# EAGLE board untitled (EAGLE 9.6.2)
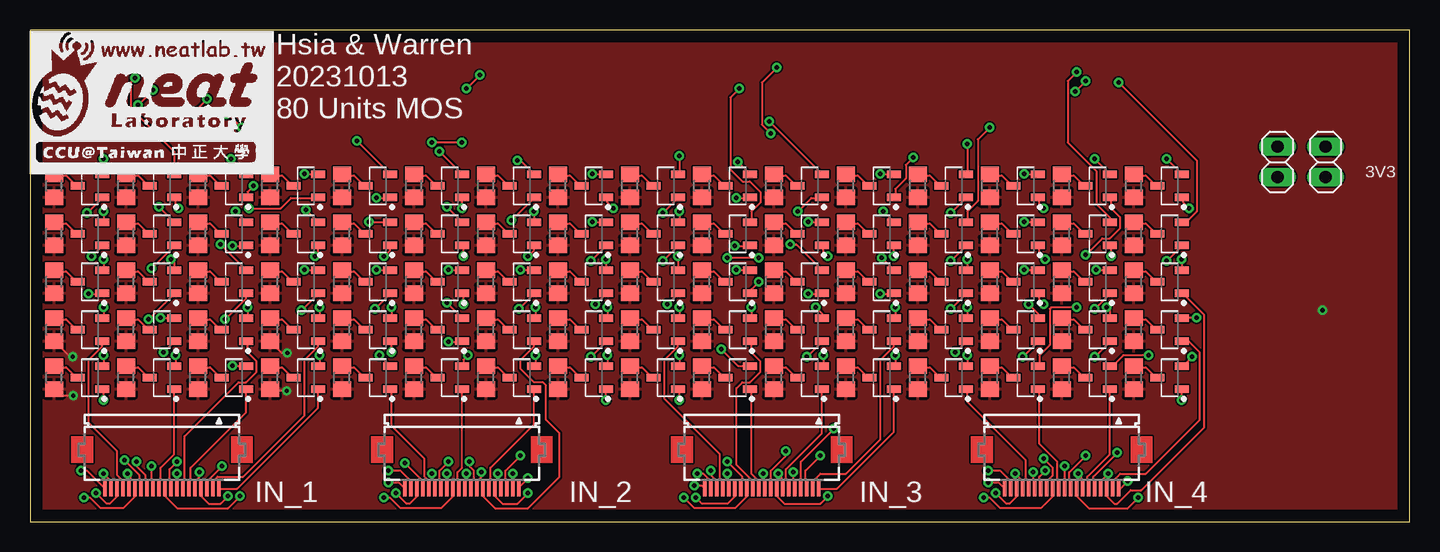
[diagram p1: board, top side]
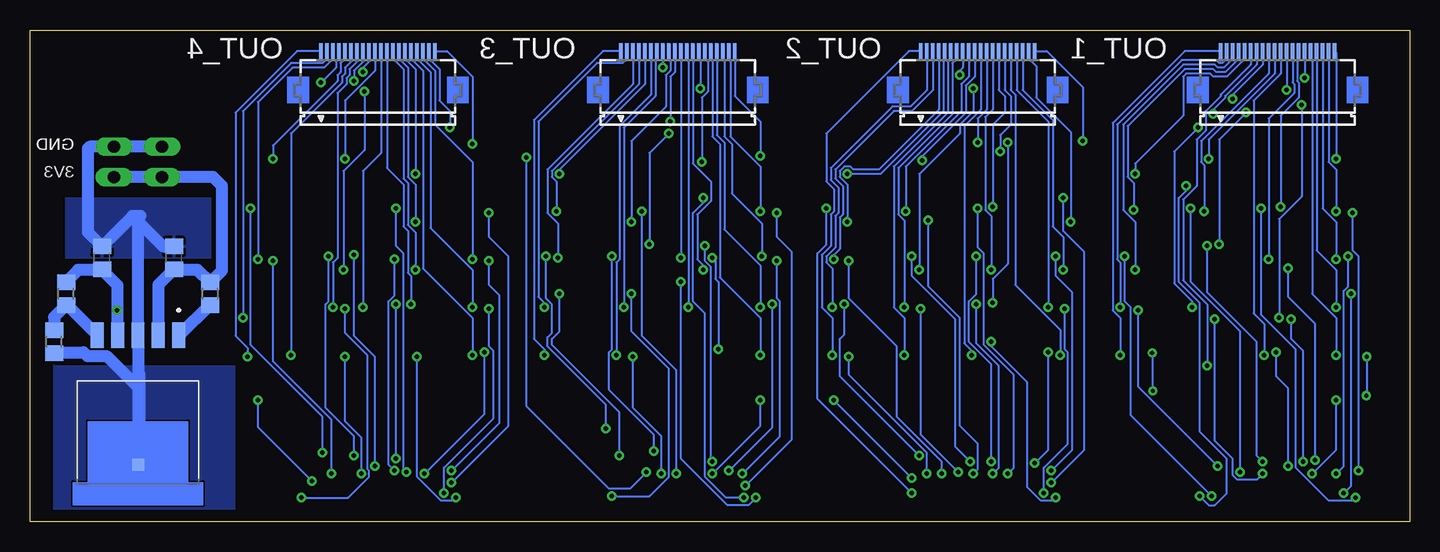
[diagram p2: board, bottom side, seen from below]

Size 115 x 41 mm. Coordinates in mm from the lower left corner, seen from the top.
Outline: 0,0 115,0 115,41 0,41 0,0
Copper layers (1*16): Top 0.035mm / dielectric 1.5mm / Bottom 0.035mm
Design rules "default": minimum track width 6mil, minimum drill 0.35mm, track to track 6mil, track to pad 6mil, pad to pad 6mil, via to via 6mil, smd to smd 6mil, copper to edge 40mil, drill to drill 6mil, minimum pad ring 10mil, minimum via ring 8mil, stop-mask expansion 4mil, vias tented up to drill 0mil, thermal gap 10mil

## Footprints (pad centres in the part's own frame; a part is rotated, then mirrored left to right if it is on the bottom)
FH12-20S-0.5SH = smd 0.3 x 1.3: 1 -4.75,3.25; 2 -4.25,3.25; 3 -3.75,3.25; 4 -3.25,3.25; 5 -2.75,3.25; 6 -2.25,3.25; 7 -1.75,3.25; 8 -1.25,3.25; 9 -0.75,3.25; 10 -0.25,3.25; 11 0.25,3.25; 12 0.75,3.25; 13 1.25,3.25; 14 1.75,3.25; 15 2.25,3.25; 16 2.75,3.25; 17 3.25,3.25; 18 3.75,3.25; 19 4.25,3.25; 20 4.75,3.25
1X02 = drill 1.016 long: 1 -1.27,0; 2 1.27,0
LP38501TS_ADJ = smd 2.16 x 1.07: ADJ -6.545,-3.4; EN -6.545,3.4; GND -6.545,0; IN -6.545,1.7; OUT -6.545,-1.7 | smd 1 x 1: DAP 4.255,0
C0805 = smd 1.3 x 1.5: 1 -0.95,0; 2 0.95,0
R0805 = smd 1.3 x 1.5: 1 -0.95,0; 2 0.95,0
SOT95P240X110-3N = smd 1.18 x 0.609: 1 -1.024,0.95; 2 -1.024,-0.95; 3 1.024,0

## Placement (x,y rotation side)
FI1  FH12-20S-0.5SH  [FH12-20S-0.5SH]  11,6 180 top
FI2  FH12-20S-0.5SH  [FH12-20S-0.5SH]  36,6 180 top
FI3  FH12-20S-0.5SH  [FH12-20S-0.5SH]  61,6 180 top
FI4  FH12-20S-0.5SH  [FH12-20S-0.5SH]  86,6 180 top
FO1  FH12-20S-0.5SH  [FH12-20S-0.5SH]  11,36 0 bottom
FO2  FH12-20S-0.5SH  [FH12-20S-0.5SH]  36,36 0 bottom
FO3  FH12-20S-0.5SH  [FH12-20S-0.5SH]  61,36 0 bottom
FO4  FH12-20S-0.5SH  [FH12-20S-0.5SH]  86,36 0 bottom
JP1  [1X02]  104,30 90 top
JP2  [1X02]  108,30 90 top
LDO  [LP38501TS_ADJ]  106,9 270 bottom
LDO_C1  10uF  [C0805]  103,22 90 bottom
LDO_C2  10uF  [C0805]  109,22 90 bottom
LDO_R1  3.3k  [R0805]  112,19 90 bottom
LDO_R2  6.8k  [R0805]  113,15 90 bottom
LDO_R3  10k  [R0805]  100,19 270 bottom
MOS1  NX6008NBKNX6008NBK  [SOT95P240X110-3N]  23,12 180 top
MOS2  NX6008NBKNX6008NBK  [SOT95P240X110-3N]  23,16 180 top
MOS3  NX6008NBKNX6008NBK  [SOT95P240X110-3N]  23,20 180 top
MOS4  NX6008NBKNX6008NBK  [SOT95P240X110-3N]  23,24 180 top
MOS5  NX6008NBKNX6008NBK  [SOT95P240X110-3N]  23,28 180 top
MOS6  NX6008NBKNX6008NBK  [SOT95P240X110-3N]  17,12 180 top
MOS7  NX6008NBKNX6008NBK  [SOT95P240X110-3N]  17,16 180 top
MOS8  NX6008NBKNX6008NBK  [SOT95P240X110-3N]  17,20 180 top
MOS9  NX6008NBKNX6008NBK  [SOT95P240X110-3N]  17,24 180 top
MOS10  NX6008NBKNX6008NBK  [SOT95P240X110-3N]  17,28 180 top
MOS11  NX6008NBKNX6008NBK  [SOT95P240X110-3N]  11,12 180 top
MOS12  NX6008NBKNX6008NBK  [SOT95P240X110-3N]  11,16 180 top
MOS13  NX6008NBKNX6008NBK  [SOT95P240X110-3N]  11,20 180 top
MOS14  NX6008NBKNX6008NBK  [SOT95P240X110-3N]  11,24 180 top
MOS15  NX6008NBKNX6008NBK  [SOT95P240X110-3N]  11,28 180 top
MOS16  NX6008NBKNX6008NBK  [SOT95P240X110-3N]  5,12 180 top
MOS17  NX6008NBKNX6008NBK  [SOT95P240X110-3N]  5,16 180 top
MOS18  NX6008NBKNX6008NBK  [SOT95P240X110-3N]  5,20 180 top
MOS19  NX6008NBKNX6008NBK  [SOT95P240X110-3N]  5,24 180 top
MOS20  NX6008NBKNX6008NBK  [SOT95P240X110-3N]  5,28 180 top
MOS21  NX6008NBKNX6008NBK  [SOT95P240X110-3N]  47,12 180 top
MOS22  NX6008NBKNX6008NBK  [SOT95P240X110-3N]  47,16 180 top
MOS23  NX6008NBKNX6008NBK  [SOT95P240X110-3N]  47,20 180 top
MOS24  NX6008NBKNX6008NBK  [SOT95P240X110-3N]  47,24 180 top
MOS25  NX6008NBKNX6008NBK  [SOT95P240X110-3N]  47,28 180 top
MOS26  NX6008NBKNX6008NBK  [SOT95P240X110-3N]  41,12 180 top
MOS27  NX6008NBKNX6008NBK  [SOT95P240X110-3N]  41,16 180 top
MOS28  NX6008NBKNX6008NBK  [SOT95P240X110-3N]  41,20 180 top
MOS29  NX6008NBKNX6008NBK  [SOT95P240X110-3N]  41,24 180 top
MOS30  NX6008NBKNX6008NBK  [SOT95P240X110-3N]  41,28 180 top
MOS31  NX6008NBKNX6008NBK  [SOT95P240X110-3N]  35,12 180 top
MOS32  NX6008NBKNX6008NBK  [SOT95P240X110-3N]  35,16 180 top
MOS33  NX6008NBKNX6008NBK  [SOT95P240X110-3N]  35,20 180 top
MOS34  NX6008NBKNX6008NBK  [SOT95P240X110-3N]  35,24 180 top
MOS35  NX6008NBKNX6008NBK  [SOT95P240X110-3N]  35,28 180 top
MOS36  NX6008NBKNX6008NBK  [SOT95P240X110-3N]  29,12 180 top
MOS37  NX6008NBKNX6008NBK  [SOT95P240X110-3N]  29,16 180 top
MOS38  NX6008NBKNX6008NBK  [SOT95P240X110-3N]  29,20 180 top
MOS39  NX6008NBKNX6008NBK  [SOT95P240X110-3N]  29,24 180 top
MOS40  NX6008NBKNX6008NBK  [SOT95P240X110-3N]  29,28 180 top
MOS41  NX6008NBKNX6008NBK  [SOT95P240X110-3N]  71,12 180 top
MOS42  NX6008NBKNX6008NBK  [SOT95P240X110-3N]  71,16 180 top
MOS43  NX6008NBKNX6008NBK  [SOT95P240X110-3N]  71,20 180 top
MOS44  NX6008NBKNX6008NBK  [SOT95P240X110-3N]  71,24 180 top
MOS45  NX6008NBKNX6008NBK  [SOT95P240X110-3N]  71,28 180 top
MOS46  NX6008NBKNX6008NBK  [SOT95P240X110-3N]  65,12 180 top
MOS47  NX6008NBKNX6008NBK  [SOT95P240X110-3N]  65,16 180 top
MOS48  NX6008NBKNX6008NBK  [SOT95P240X110-3N]  65,20 180 top
MOS49  NX6008NBKNX6008NBK  [SOT95P240X110-3N]  65,24 180 top
MOS50  NX6008NBKNX6008NBK  [SOT95P240X110-3N]  65,28 180 top
MOS51  NX6008NBKNX6008NBK  [SOT95P240X110-3N]  59,12 180 top
MOS52  NX6008NBKNX6008NBK  [SOT95P240X110-3N]  59,16 180 top
MOS53  NX6008NBKNX6008NBK  [SOT95P240X110-3N]  59,20 180 top
MOS54  NX6008NBKNX6008NBK  [SOT95P240X110-3N]  59,24 180 top
MOS55  NX6008NBKNX6008NBK  [SOT95P240X110-3N]  59,28 180 top
MOS56  NX6008NBKNX6008NBK  [SOT95P240X110-3N]  53,12 180 top
MOS57  NX6008NBKNX6008NBK  [SOT95P240X110-3N]  53,16 180 top
MOS58  NX6008NBKNX6008NBK  [SOT95P240X110-3N]  53,20 180 top
MOS59  NX6008NBKNX6008NBK  [SOT95P240X110-3N]  53,24 180 top
MOS60  NX6008NBKNX6008NBK  [SOT95P240X110-3N]  53,28 180 top
MOS61  NX6008NBKNX6008NBK  [SOT95P240X110-3N]  95,12 180 top
MOS62  NX6008NBKNX6008NBK  [SOT95P240X110-3N]  95,16 180 top
MOS63  NX6008NBKNX6008NBK  [SOT95P240X110-3N]  95,20 180 top
MOS64  NX6008NBKNX6008NBK  [SOT95P240X110-3N]  95,24 180 top
MOS65  NX6008NBKNX6008NBK  [SOT95P240X110-3N]  95,28 180 top
MOS66  NX6008NBKNX6008NBK  [SOT95P240X110-3N]  89,12 180 top
MOS67  NX6008NBKNX6008NBK  [SOT95P240X110-3N]  89,16 180 top
MOS68  NX6008NBKNX6008NBK  [SOT95P240X110-3N]  89,20 180 top
MOS69  NX6008NBKNX6008NBK  [SOT95P240X110-3N]  89,24 180 top
MOS70  NX6008NBKNX6008NBK  [SOT95P240X110-3N]  89,28 180 top
MOS71  NX6008NBKNX6008NBK  [SOT95P240X110-3N]  83,12 180 top
MOS72  NX6008NBKNX6008NBK  [SOT95P240X110-3N]  83,16 180 top
MOS73  NX6008NBKNX6008NBK  [SOT95P240X110-3N]  83,20 180 top
MOS74  NX6008NBKNX6008NBK  [SOT95P240X110-3N]  83,24 180 top
MOS75  NX6008NBKNX6008NBK  [SOT95P240X110-3N]  83,28 180 top
MOS76  NX6008NBKNX6008NBK  [SOT95P240X110-3N]  77,12 180 top
MOS77  NX6008NBKNX6008NBK  [SOT95P240X110-3N]  77,16 180 top
MOS78  NX6008NBKNX6008NBK  [SOT95P240X110-3N]  77,20 180 top
MOS79  NX6008NBKNX6008NBK  [SOT95P240X110-3N]  77,24 180 top
MOS80  NX6008NBKNX6008NBK  [SOT95P240X110-3N]  77,28 180 top
R1  0  [R0805]  20,12 90 top
R2  0  [R0805]  20,16 90 top
R3  0  [R0805]  20,20 90 top
R4  0  [R0805]  20,24 90 top
R5  0  [R0805]  20,28 90 top
R6  0  [R0805]  14,12 90 top
R7  0  [R0805]  14,16 90 top
R8  0  [R0805]  14,20 90 top
R9  0  [R0805]  14,24 90 top
R10  0  [R0805]  14,28 90 top
R11  0  [R0805]  8,12 90 top
R12  0  [R0805]  8,16 90 top
R13  0  [R0805]  8,20 90 top
R14  0  [R0805]  8,24 90 top
R15  0  [R0805]  8,28 90 top
R16  0  [R0805]  2,12 90 top
R17  0  [R0805]  2,16 90 top
R18  0  [R0805]  2,20 90 top
R19  0  [R0805]  2,24 90 top
R20  0  [R0805]  2,28 90 top
R21  0  [R0805]  44,12 90 top
R22  0  [R0805]  44,16 90 top
R23  0  [R0805]  44,20 90 top
R24  0  [R0805]  44,24 90 top
R25  0  [R0805]  44,28 90 top
R26  0  [R0805]  38,12 90 top
R27  0  [R0805]  38,16 90 top
R28  0  [R0805]  38,20 90 top
R29  0  [R0805]  38,24 90 top
R30  0  [R0805]  38,28 90 top
R31  0  [R0805]  32,12 90 top
R32  0  [R0805]  32,16 90 top
R33  0  [R0805]  32,20 90 top
R34  0  [R0805]  32,24 90 top
R35  0  [R0805]  32,28 90 top
R36  0  [R0805]  26,12 90 top
R37  0  [R0805]  26,16 90 top
R38  0  [R0805]  26,20 90 top
R39  0  [R0805]  26,24 90 top
R40  0  [R0805]  26,28 90 top
R41  0  [R0805]  68,12 90 top
R42  0  [R0805]  68,16 90 top
R43  0  [R0805]  68,20 90 top
R44  0  [R0805]  68,24 90 top
R45  0  [R0805]  68,28 90 top
R46  0  [R0805]  62,12 90 top
R47  0  [R0805]  62,16 90 top
R48  0  [R0805]  62,20 90 top
R49  0  [R0805]  62,24 90 top
R50  0  [R0805]  62,28 90 top
R51  0  [R0805]  56,12 90 top
R52  0  [R0805]  56,16 90 top
R53  0  [R0805]  56,20 90 top
R54  0  [R0805]  56,24 90 top
R55  0  [R0805]  56,28 90 top
R56  0  [R0805]  50,12 90 top
R57  0  [R0805]  50,16 90 top
R58  0  [R0805]  50,20 90 top
R59  0  [R0805]  50,24 90 top
R60  0  [R0805]  50,28 90 top
R61  0  [R0805]  92,12 90 top
R62  0  [R0805]  92,16 90 top
R63  0  [R0805]  92,20 90 top
R64  0  [R0805]  92,24 90 top
R65  0  [R0805]  92,28 90 top
R66  0  [R0805]  86,12 90 top
R67  0  [R0805]  86,16 90 top
R68  0  [R0805]  86,20 90 top
R69  0  [R0805]  86,24 90 top
R70  0  [R0805]  86,28 90 top
R71  0  [R0805]  80,12 90 top
R72  0  [R0805]  80,16 90 top
R73  0  [R0805]  80,20 90 top
R74  0  [R0805]  80,24 90 top
R75  0  [R0805]  80,28 90 top
R76  0  [R0805]  74,12 90 top
R77  0  [R0805]  74,16 90 top
R78  0  [R0805]  74,20 90 top
R79  0  [R0805]  74,24 90 top
R80  0  [R0805]  74,28 90 top
U$1  [LOGO_SCALE_2.0]  0,29 0 top

## Tracks (layer width: path | path; a pad name or v marks a point on that pad's centre or on a via)
GND
  Bottom 0.152: LDO_R2.1 113,14.12 | 106,11.2 106,5.2 LDO.DAP
  Bottom 1.016: 113,14.12 110.53,14.12 110.21,13.8 108.61,13.8 106,11.2 | 105.9,12.4 105.9,5.3 106,5.2 | 106,25.3 105.8,25.5 106.45,25.5 | 106.45,25.5 LDO_C2.2 110.18,24.13 110.18,31.12 110.03,31.27 JP2.2 JP1.2 | 106.45,25.5 105.92,24.98 | 105.92,24.98 103.9,22.95 LDO_C1.2 | 105.92,24.98 106,24.9 LDO.GND LDO.DAP
  pour Bottom: 100,27 100,22 112,22 112,27
  pour Bottom: 98,13 98,1 113,1 113,13
INPUT1_1
  Top 0.152: FI1.1 17.25,2.75 24,9.5 24,11 MOS1.1
INPUT1_2
  Top 0.152: FI1.2 15.25,3.38 15.62,3.75 17.75,3.75 22.88,8.88 22.88,13.5 24,14.62 24,15 MOS2.1
INPUT1_3  (via drill 0.35)
  Top 0.152: v22.62,17.62 24,19 MOS3.1 | v16,4.62 14.75,3.38 FI1.3
  Bottom 0.152: v22.62,17.62 22.62,11.25 v16,4.62
INPUT1_4  (via drill 0.35)
  Top 0.152: v23.75,22.12 24,22.38 24,23 MOS4.1 | v16.5,2.12 15.88,1.5 14.88,1.5 14.25,2.12 FI1.4
  Bottom 0.152: v23.75,22.12 23.75,18.38 23.25,17.88 23.25,8.88 v16.5,2.12
INPUT1_5  (via drill 0.35)
  Top 0.152: v18.25,26.12 20.88,26.12 21.75,27 24,27 MOS5.1 | v14.12,4.12 14.12,3.75 13.75,3.38 FI1.5
  Bottom 0.152: v18.25,26.12 18.25,20 14.12,15.88 v14.12,4.12
INPUT1_6
  Top 0.152: FI1.6 13.25,3.38 13.38,3.5 13.38,4.5 18,9.12 18,11 MOS6.1
INPUT1_7
  Top 0.152: FI1.7 12.75,3.38 12.88,3.5 12.88,7.12 17.38,11.62 18,11.62 18.88,12.5 18.88,13.38 18.12,14.12 18.12,15 MOS7.1
INPUT1_8  (via drill 0.35)
  Top 0.152: v16.25,16.88 18,18.62 18,19 MOS8.1 | FI1.8 v12.25,4
  Bottom 0.152: v16.25,16.88 16.25,6.75 14.75,5.25 14.75,3.88 14.38,3.5 12.75,3.5 v12.25,4
INPUT1_9  (via drill 0.35)
  Top 0.152: v16.88,23 18,23 MOS9.1 | v12.25,5 11.62,4.38 11.62,3.5 11.75,3.38 FI1.9
  Bottom 0.152: v16.88,23 16.88,19.12 12.75,15 12.75,5.5 v12.25,5
INPUT1_10  (via drill 0.35)
  Top 0.152: v18.62,28 18.12,27.5 18.12,27.12 MOS10.1 | v17.5,2.12 16.5,1.12 12.25,1.12 11.25,2.12 FI1.10
  Bottom 0.152: v18.62,28 18.62,27.62 19.25,27 19.25,20 17.5,18.25 17.5,7.5 15.25,5.25 15.25,2.38 16.25,1.38 16.75,1.38 v17.5,2.12
INPUT1_11
  Top 0.152: FI1.11 10.75,3.38 10.88,3.5 10.88,4.5 12,5.62 12,11 MOS11.1
INPUT1_12  (via drill 0.35)
  Top 0.152: v11.12,14.12 12,15 MOS12.1 | v10.12,4.62 10.12,3.5 10.25,3.38 FI1.12
  Bottom 0.152: v11.12,14.12 11.12,12.12 10.12,11.12 v10.12,4.62
INPUT1_13  (via drill 0.35)
  Top 0.152: v9.88,16.88 12,19 MOS13.1 | v8.88,5 8.88,4.62 9.62,3.88 9.62,3.5 9.75,3.38 FI1.13
  Bottom 0.152: v9.88,16.88 9.88,15.25 8.88,14.25 v8.88,5
INPUT1_14  (via drill 0.35)
  Top 0.152: v10.12,21.12 12,23 MOS14.1 | v7.88,5.12 9.12,3.88 9.12,3.5 9.25,3.38 FI1.14
  Bottom 0.152: v10.12,21.12 10.12,18.75 7.88,16.5 v7.88,5.12
INPUT1_15  (via drill 0.35)
  Top 0.152: v12.38,26.12 12.12,26.38 12.12,27 MOS15.1 | v4.5,2 5,2 5.88,1.12 7.75,1.12 8.75,2.12 FI1.15
  Bottom 0.152: v12.38,26.12 12.38,17.25 9.5,14.38 9.5,4.5 6.75,1.75 4.75,1.75 v4.5,2
INPUT1_16  (via drill 0.35)
  Top 0.152: v6.12,10.12 6.12,11 MOS16.1 | v8.12,4 8.38,3.75 8.38,3.5 8.25,3.38 FI1.16
  Bottom 0.152: v6.12,10.12 6.12,6 v8.12,4
INPUT1_17
  Top 0.152: FI1.17 7.75,3.38 7.25,3.88 7.25,5.88 4.88,8.25 4.88,13.5 6,14.62 6,15 MOS17.1
INPUT1_18  (via drill 0.35)
  Top 0.152: v4.88,19 6,19 MOS18.1 | v5.5,2.38 6.38,1.5 6.62,1.5 7.25,2.12 FI1.18
  Bottom 0.152: v4.88,19 4.88,3 v5.5,2.38
INPUT1_19  (via drill 0.35)
  Top 0.152: v5.12,22.12 6,23 MOS19.1 | v6.12,4 6.75,3.38 FI1.19
  Bottom 0.152: v5.12,22.12 5.12,19.62 5.5,19.25 5.5,4.62 v6.12,4
INPUT1_20  (via drill 0.35)
  Top 0.152: v4.75,25.75 6,27 MOS20.1 | v4.25,4.25 4.75,4.25 FI1.20
  Bottom 0.152: v4.75,25.75 4.75,22.62 4.25,22.12 v4.25,4.25
INPUT2_1  (via drill 0.35)
  Top 0.152: v48,10.12 48,11 MOS21.1 | v41.5,3.62 40.75,2.88 FI2.1
  Bottom 0.152: v41.5,3.62 v48,10.12
INPUT2_2  (via drill 0.35)
  Top 0.152: v46.75,13.75 48,15 MOS22.1 | FI2.2 v40.25,4
  Bottom 0.152: v46.75,13.75 46.75,12.25 40.25,5.75 v40.25,4
INPUT2_3  (via drill 0.35)
  Top 0.152: v47.12,18.12 48,19 MOS23.1 | v40.88,5.5 39.62,4.25 39.62,3.5 39.75,3.38 FI2.3
  Bottom 0.152: v47.12,18.12 47.12,15.62 47.5,15.25 47.5,12.12 v40.88,5.5
INPUT2_4  (via drill 0.35)
  Top 0.152: v46.75,21.75 48,23 MOS24.1 | v39,4 39,3.62 39.25,3.38 FI2.4
  Bottom 0.152: v46.75,21.75 46.75,18.62 42.75,14.62 42.75,8.75 39,5 v39,4
INPUT2_5  (via drill 0.35)
  Top 0.152: v48.62,26.12 48.12,26.62 48.12,27 MOS25.1 | v41.5,2.38 40.62,1.5 39.38,1.5 38.75,2.12 FI2.5
  Bottom 0.152: v48.62,26.12 48.62,23.12 49.38,22.38 49.38,10.25 v41.5,2.38
INPUT2_6
  Top 0.152: FI2.6 38.25,3.38 38.38,3.5 38.38,4.5 42,8.12 42,11 MOS26.1
INPUT2_7
  Top 0.152: FI2.7 37.75,2.12 38.75,1.12 41.5,1.12 44.12,3.75 44.12,7.38 43,8.5 43,11.38 42.75,11.62 42,11.62 40.88,12.75 40.88,13.5 42,14.62 42,15 MOS27.1
INPUT2_8  (via drill 0.35)
  Top 0.152: v40.75,17.75 42,19 MOS28.1 | v37.62,4.12 37.62,3.75 37.25,3.38 FI2.8
  Bottom 0.152: v40.75,17.75 40.75,7.25 v37.62,4.12
INPUT2_9  (via drill 0.35)
  Top 0.152: v41.5,22.12 42,22.62 42,23 MOS29.1 | v36.62,5 36.62,4.62 37,4.25 37,3.62 36.75,3.38 FI2.9
  Bottom 0.152: v41.5,22.12 41.5,20.5 37.88,16.88 37.88,6.25 v36.62,5
INPUT2_10  (via drill 0.35)
  Top 0.152: v40.12,25.12 42,27 MOS30.1 | v36.38,4 36.38,3.5 36.25,3.38 FI2.10
  Bottom 0.152: v40.12,25.12 40.12,19.62 37.5,17 37.5,8 36,6.5 36,4.38 v36.38,4
INPUT2_11
  Top 0.152: FI2.11 35.75,3.38 35.62,3.5 35.62,4.12 36,4.5 36,11 MOS31.1
INPUT2_12  (via drill 0.35)
  Top 0.152: v34.88,15 36,15 MOS32.1 | v29.5,2 30,2 30.88,1.12 34.25,1.12 35.25,2.12 FI2.12
  Bottom 0.152: v34.88,15 34.88,14.62 31.88,11.62 31.88,2.88 30.75,1.75 29.75,1.75 v29.5,2
INPUT2_13  (via drill 0.35)
  Top 0.152: v36.12,18.12 36.12,19 MOS33.1 | FI2.13 v34.75,4
  Bottom 0.152: v36.12,18.12 36.12,14.88 34.25,13 34.25,4.5 v34.75,4
INPUT2_14  (via drill 0.35)
  Top 0.152: v36.12,22.12 36.12,23 MOS34.1 | v34.88,5 34.12,4.25 34.12,3.5 34.25,3.38 FI2.14
  Bottom 0.152: v36.12,22.12 36.12,19 36.75,18.38 36.75,15 34.88,13.12 v34.88,5
INPUT2_15  (via drill 0.35)
  Top 0.152: v36,26.12 36,27 MOS35.1 | v33.5,4 33.5,3.62 33.75,3.38 FI2.15
  Bottom 0.152: v36,26.12 36,22.88 35.5,22.38 35.5,14.75 33,12.25 33,4.5 v33.5,4
INPUT2_16
  Top 0.152: FI2.16 33.25,3.38 32.88,3.75 32.88,5.25 30.12,8 30.12,11 MOS36.1
INPUT2_17  (via drill 0.35)
  Top 0.152: v30.12,14.12 30.12,15 MOS37.1 | v31.25,4.88 32.75,3.38 FI2.17
  Bottom 0.152: v30.12,14.12 30.12,6 v31.25,4.88
INPUT2_18  (via drill 0.35)
  Top 0.152: v28.75,17.75 30,19 MOS38.1 | v30.5,2.38 31.38,1.5 31.62,1.5 32.25,2.12 FI2.18
  Bottom 0.152: v28.75,17.75 28.75,14.38 28.5,14.12 28.5,6.5 30.5,4.5 v30.5,2.38
INPUT2_19  (via drill 0.35)
  Top 0.152: v29.5,22.12 30,22.62 30,23 MOS39.1 | v29.88,4.25 30.88,4.25 31.75,3.38 FI2.19
  Bottom 0.152: v29.5,22.12 29.5,20.5 28.12,19.12 28.12,6 v29.88,4.25
INPUT2_20  (via drill 0.35)
  Top 0.152: v28.88,27 30,27 MOS40.1 | v29.88,3.25 30.75,3.25 FI2.20
  Bottom 0.152: v28.88,27 28.88,24.25 27.12,22.5 27.12,6 v29.88,3.25
INPUT3_1
  Top 0.152: FI3.1 67.25,2.75 72,7.5 72,11 MOS41.1
INPUT3_2
  Top 0.152: FI3.2 65.25,3.38 65.88,4 68,4 70.88,6.88 70.88,13.5 72,14.62 72,15 MOS42.1
INPUT3_3  (via drill 0.35)
  Top 0.152: v70.88,19 72,19 MOS43.1 | v65.88,5.5 64.62,4.25 64.62,3.5 64.75,3.38 FI3.3
  Bottom 0.152: v70.88,19 70.88,15.88 71.5,15.25 71.5,14.75 65.88,9.12 v65.88,5.5
INPUT3_4  (via drill 0.35)
  Top 0.152: v72,22.12 72,23 MOS44.1 | v67,7.75 64.25,5 FI3.4
  Bottom 0.152: v72,22.12 72,18.62 71.5,18.12 71.5,15.75 71.88,15.38 71.88,14.62 67,9.75 v67,7.75
INPUT3_5  (via drill 0.35)
  Top 0.152: v73.62,30.38 73,29.75 73,28.62 72.12,27.75 72.12,27.12 MOS45.1 | v63.62,4.12 63.62,3.5 63.75,3.38 FI3.5
  Bottom 0.152: v73.62,30.38 73.62,9.62 66.75,2.75 65,2.75 v63.62,4.12
INPUT3_6
  Top 0.152: FI3.6 63.25,3.38 63,3.62 63,4.38 66,7.38 66,11 MOS46.1
INPUT3_7  (via drill 0.35)
  Top 0.152: v64.75,13.75 66,15 MOS47.1 | v62.38,4 62.62,3.75 62.62,3.5 62.75,3.38 FI3.7
  Bottom 0.152: v64.75,13.75 64.75,9.5 62.38,7.12 v62.38,4
INPUT3_8  (via drill 0.35)
  Top 0.152: v64.88,19 66,19 MOS48.1 | v66.5,2.12 65.88,1.5 62.88,1.5 62.25,2.12 FI3.8
  Bottom 0.152: v64.88,19 64.88,15.88 61.75,12.75 61.75,3.75 63.38,2.12 v66.5,2.12
INPUT3_9  (via drill 0.35)
  Top 0.152: v66.5,22.12 66.12,22.5 66.12,23 MOS49.1 | v63,5.88 63,5.5 61.75,4.25 FI3.9
  Bottom 0.152: v66.5,22.12 66.5,14.38 66.75,14.12 66.75,11 63,7.25 v63,5.88
INPUT3_10  (via drill 0.35)
  Top 0.152: v64,25.88 65.12,27 66,27 MOS50.1 | v61.12,4 61.12,3.5 61.25,3.38 FI3.10
  Bottom 0.152: v64,25.88 64,15.5 61.12,12.62 v61.12,4
INPUT3_11
  Top 0.152: FI3.11 60.75,3.38 60.12,4 60.12,11 MOS51.1
INPUT3_12
  Top 0.152: FI3.12 60.25,3.38 58.88,4.75 58.88,11.12 59.38,11.62 60,11.62 60.88,12.5 60.88,13.38 60.12,14.12 60.12,15 MOS52.1
INPUT3_13  (via drill 0.35)
  Top 0.152: v60.75,20 60.12,19.38 60.12,19.12 MOS53.1 | v54.5,2 55.38,1.12 58.75,1.12 59.75,2.12 FI3.13
  Bottom 0.152: v60.75,20 60.75,5.25 56.88,1.38 55.12,1.38 v54.5,2
INPUT3_14  (via drill 0.35)
  Top 0.152: v58.75,23 60,23 MOS54.1 | v58.12,5 59.38,3.75 59.38,3.5 59.25,3.38 FI3.14
  Bottom 0.152: v58.75,23 58.75,21.75 58.25,21.25 58.25,5.12 v58.12,5
INPUT3_15  (via drill 0.35)
  Top 0.152: v58.88,27 60,27 MOS55.1 | v55.5,2 56,1.5 58.12,1.5 58.75,2.12 FI3.15
  Bottom 0.152: v58.88,27 58.88,26.62 59.75,25.75 59.75,18.38 58.75,17.38 58.75,3.75 57,2 v55.5,2
INPUT3_16  (via drill 0.35)
  Top 0.152: v54.12,10.12 54.12,11 MOS56.1 | v58.12,4 58.12,3.5 58.25,3.38 FI3.16
  Bottom 0.152: v54.12,10.12 54.12,8 v58.12,4
INPUT3_17
  Top 0.152: FI3.17 57.75,3.38 57.5,3.62 57.5,5.62 52.88,10.25 52.88,13.5 54,14.62 54,15 MOS57.1
INPUT3_18  (via drill 0.35)
  Top 0.152: v53.12,18.12 54,19 MOS58.1 | v56.75,4.25 56.75,3.88 57.25,3.38 FI3.18
  Bottom 0.152: v53.12,18.12 53.12,7.88 v56.75,4.25
INPUT3_19  (via drill 0.35)
  Top 0.152: v52.75,21.75 54,23 MOS59.1 | v55.62,4 56.12,4 56.75,3.38 FI3.19
  Bottom 0.152: v52.75,21.75 52.75,18.62 52.5,18.38 52.5,7.12 v55.62,4
INPUT3_20  (via drill 0.35)
  Top 0.152: v52.75,25.75 54,27 MOS60.1 | v55.38,3 56,3 FI3.20
  Bottom 0.152: v52.75,25.75 52.75,23.75 51.5,22.5 51.5,6.88 v55.38,3
INPUT4_1  (via drill 0.35)
  Top 0.152: v96,10.12 96,11 MOS61.1 | v91.5,3.38 90.88,2.75 FI4.1
  Bottom 0.152: v96,10.12 96,7.88 v91.5,3.38
INPUT4_2
  Top 0.152: FI4.2 90.25,3.38 90.88,4 93,4 97.5,8.5 97.5,14.12 96.62,15 96.12,15 MOS62.1
INPUT4_3
  Top 0.152: FI4.3 89.75,2.12 90.38,1.5 90.62,1.5 91.75,2.62 92.62,2.62 97.88,7.88 97.88,17.25 96.12,19 MOS63.1
INPUT4_4  (via drill 0.35)
  Top 0.152: v94.75,21.75 96,23 MOS64.1 | v89.88,4 89.25,3.38 FI4.4
  Bottom 0.152: v94.75,21.75 94.75,13.38 89.88,8.5 v89.88,4
INPUT4_5  (via drill 0.35)
  Top 0.152: v96.62,26.12 96.12,26.62 96.12,27 MOS65.1 | v90.62,5.75 88.62,3.75 88.62,3.5 88.75,3.38 FI4.5
  Bottom 0.152: v96.62,26.12 96.62,14.75 90.62,8.75 v90.62,5.75
INPUT4_6
  Top 0.152: FI4.6 88.25,3.38 88.12,3.5 88.12,3.75 90,5.62 90,11 MOS66.1
INPUT4_7  (via drill 0.35)
  Top 0.152: v88.75,13.75 90,15 MOS67.1 | v87.38,4 87.62,3.75 87.62,3.5 87.75,3.38 FI4.7
  Bottom 0.152: v88.75,13.75 88.75,8.38 87.38,7 v87.38,4
INPUT4_8  (via drill 0.35)
  Top 0.152: v88.75,17.75 90,19 MOS68.1 | v92.38,2 91.5,1.12 88.25,1.12 87.25,2.12 FI4.8
  Bottom 0.152: v88.75,17.75 88.75,15.75 86.88,13.88 86.88,4.38 86.75,4.25 86.75,3.75 88.5,2 v92.38,2
INPUT4_9  (via drill 0.35)
  Top 0.152: v90.12,22.12 90.12,23 MOS69.1 | v88,5.5 86.62,4.12 86.62,3.5 86.75,3.38 FI4.9
  Bottom 0.152: v90.12,22.12 90.12,18.38 90.38,18.12 90.38,9.5 88,7.12 v88,5.5
INPUT4_10  (via drill 0.35)
  Top 0.152: v88,22.25 89.38,23.62 90,23.62 90.88,24.5 90.88,25.38 90.12,26.12 90.12,27 MOS70.1 | FI4.10 v86.25,4.62
  Bottom 0.152: v88,22.25 88,15.5 86.25,13.75 v86.25,4.62
INPUT4_11
  Top 0.152: FI4.11 85.75,3.38 85.62,3.5 85.62,5 84.12,6.5 84.12,11 MOS71.1
INPUT4_12  (via drill 0.35)
  Top 0.152: v82.75,13.75 84,15 MOS72.1 | v79.5,2 80,2 80.88,1.12 84.25,1.12 85.25,2.12 FI4.12
  Bottom 0.152: v82.75,13.75 82.75,3.75 80.75,1.75 79.75,1.75 v79.5,2
INPUT4_13  (via drill 0.35)
  Top 0.152: v84.5,18.12 84.12,18.5 84.12,19 MOS73.1 | v84.5,5.25 85.25,4.5 85.25,3.88 84.75,3.38 FI4.13
  Bottom 0.152: v84.5,5.25 v84.5,18.12
INPUT4_14  (via drill 0.35)
  Top 0.152: v84.62,21.88 84.12,22.38 84.12,23 MOS74.1 | v84.62,4.25 84.12,3.75 84.12,3.5 84.25,3.38 FI4.14
  Bottom 0.152: v84.62,21.88 84.62,18.88 85.12,18.38 85.12,4.75 v84.62,4.25
INPUT4_15  (via drill 0.35)
  Top 0.152: v84.5,26.12 84.12,26.5 84.12,27 MOS75.1 | v83.62,4.12 83.62,3.5 83.75,3.38 FI4.15
  Bottom 0.152: v84.5,26.12 84.5,23 83.88,22.38 83.88,4.38 v83.62,4.12
INPUT4_16
  Top 0.152: FI4.16 83.25,3.38 83,3.62 83,5.12 78.12,10 78.12,11 MOS76.1
INPUT4_17  (via drill 0.35)
  Top 0.152: v77.12,14.12 78,15 MOS77.1 | v82.12,4 82.75,3.38 FI4.17
  Bottom 0.152: v77.12,14.12 77.12,9 v82.12,4
INPUT4_18  (via drill 0.35)
  Top 0.152: v76.75,17.75 78,19 MOS78.1 | v80.5,2.38 81.38,1.5 81.62,1.5 82.25,2.12 FI4.18
  Bottom 0.152: v76.75,17.75 76.75,14.62 76.38,14.25 76.38,8.62 80.5,4.5 v80.5,2.38
INPUT4_19  (via drill 0.35)
  Top 0.152: v76.75,21.75 78,23 MOS79.1 | v79.88,4.25 80.88,4.25 81.75,3.38 FI4.19
  Bottom 0.152: v76.75,21.75 76.75,19.75 75.88,18.88 75.88,8.25 v79.88,4.25
INPUT4_20  (via drill 0.35)
  Top 0.152: v76.75,25.75 78,27 MOS80.1 | v79.88,3.25 80.75,3.25 FI4.20
  Bottom 0.152: v76.75,25.75 76.75,23.75 75.12,22.12 75.12,8 v79.88,3.25
N$1
  Bottom 1.016: LDO_R3.2 102.5,15.54 LDO.EN
N$2
  Top 0.152: MOS77.3 75.88,16 75,16.88 74,16.88 R77.2
N$4
  Bottom 1.016: LDO.ADJ 111.91,18.05 LDO_R1.1 113,17.05 LDO_R2.2
N$5
  Top 0.152: MOS1.3 21.88,12 21,12.88 20,12.88 R1.2
N$6
  Top 0.152: MOS2.3 21.88,16 21,16.88 20,16.88 R2.2
N$10
  Top 0.152: MOS3.3 21.88,20 21,20.88 20,20.88 R3.2
N$14
  Top 0.152: MOS4.3 21.88,24 21,24.88 20,24.88 R4.2
N$18
  Top 0.152: MOS5.3 21.88,28 21,28.88 20,28.88 R5.2
N$22
  Top 0.152: MOS6.3 15.88,12 15,12.88 14,12.88 R6.2
N$26
  Top 0.152: MOS7.3 15.88,16 15,16.88 14,16.88 R7.2
N$30
  Top 0.152: MOS8.3 15.88,20 15,20.88 14,20.88 R8.2
N$34
  Top 0.152: MOS9.3 15.88,24 15,24.88 14,24.88 R9.2
N$38
  Top 0.152: MOS10.3 15.88,28 15,28.88 14,28.88 R10.2
N$40
  Top 0.152: MOS11.3 9.88,12 9,12.88 8,12.88 R11.2
N$43
  Top 0.152: MOS12.3 9.88,16 9,16.88 8,16.88 R12.2
N$47
  Top 0.152: MOS13.3 9.88,20 9,20.88 8,20.88 R13.2
N$51
  Top 0.152: MOS14.3 9.88,24 9,24.88 8,24.88 R14.2
N$55
  Top 0.152: MOS15.3 9.88,28 9,28.88 8,28.88 R15.2
N$59
  Top 0.152: MOS16.3 3.88,12 3,12.88 2,12.88 R16.2
N$63
  Top 0.152: MOS17.3 3.88,16 3,16.88 2,16.88 R17.2
N$67
  Top 0.152: MOS18.3 3.88,20 3,20.88 2,20.88 R18.2
N$71
  Top 0.152: MOS19.3 3.88,24 3,24.88 2,24.88 R19.2
N$75
  Top 0.152: MOS20.3 3.88,28 3,28.88 2,28.88 R20.2
N$77
  Top 0.152: MOS21.3 45.88,12 45,12.88 44,12.88 R21.2
N$80
  Top 0.152: MOS22.3 45.88,16 45,16.88 44,16.88 R22.2
N$84
  Top 0.152: MOS23.3 45.88,20 45,20.88 44,20.88 R23.2
N$88
  Top 0.152: MOS24.3 45.88,24 45,24.88 44,24.88 R24.2
N$92
  Top 0.152: MOS25.3 45.88,28 45,28.88 44,28.88 R25.2
N$96
  Top 0.152: MOS26.3 39.88,12 39,12.88 38,12.88 R26.2
N$100
  Top 0.152: MOS27.3 39.88,16 39,16.88 38,16.88 R27.2
N$104
  Top 0.152: MOS28.3 39.88,20 39,20.88 38,20.88 R28.2
N$108
  Top 0.152: MOS29.3 39.88,24 39,24.88 38,24.88 R29.2
N$112
  Top 0.152: MOS30.3 39.88,28 39,28.88 38,28.88 R30.2
N$114
  Top 0.152: MOS31.3 33.88,12 33,12.88 32,12.88 R31.2
N$117
  Top 0.152: MOS32.3 33.88,16 33,16.88 32,16.88 R32.2
N$121
  Top 0.152: MOS33.3 33.88,20 33,20.88 32,20.88 R33.2
N$125
  Top 0.152: MOS34.3 33.88,24 33,24.88 32,24.88 R34.2
N$129
  Top 0.152: MOS35.3 33.88,28 33,28.88 32,28.88 R35.2
N$133
  Top 0.152: MOS36.3 27.88,12 27,12.88 26,12.88 R36.2
N$137
  Top 0.152: MOS37.3 27.88,16 27,16.88 26,16.88 R37.2
N$141
  Top 0.152: MOS38.3 27.88,20 27,20.88 26,20.88 R38.2
N$145
  Top 0.152: MOS39.3 27.88,24 27,24.88 26,24.88 R39.2
N$149
  Top 0.152: MOS40.3 27.88,28 27,28.88 26,28.88 R40.2
N$151
  Top 0.152: MOS41.3 69.88,12 69,12.88 68,12.88 R41.2
N$154
  Top 0.152: MOS42.3 69.88,16 69,16.88 68,16.88 R42.2
N$158
  Top 0.152: MOS43.3 69.88,20 69,20.88 68,20.88 R43.2
N$162
  Top 0.152: MOS44.3 69.88,24 69,24.88 68,24.88 R44.2
N$166
  Top 0.152: MOS45.3 69.88,28 69,28.88 68,28.88 R45.2
N$170
  Top 0.152: MOS46.3 63.88,12 63,12.88 62,12.88 R46.2
N$174
  Top 0.152: MOS47.3 63.88,16 63,16.88 62,16.88 R47.2
N$178
  Top 0.152: MOS48.3 63.88,20 63,20.88 62,20.88 R48.2
N$182
  Top 0.152: MOS49.3 63.88,24 63,24.88 62,24.88 R49.2
N$186
  Top 0.152: MOS50.3 63.88,28 63,28.88 62,28.88 R50.2
N$188
  Top 0.152: MOS51.3 57.88,12 57,12.88 56,12.88 R51.2
N$191
  Top 0.152: MOS52.3 57.88,16 57,16.88 56,16.88 R52.2
N$195
  Top 0.152: MOS53.3 57.88,20 57,20.88 56,20.88 R53.2
N$199
  Top 0.152: MOS54.3 57.88,24 57,24.88 56,24.88 R54.2
N$203
  Top 0.152: MOS55.3 57.88,28 57,28.88 56,28.88 R55.2
N$207
  Top 0.152: MOS56.3 51.88,12 51,12.88 50,12.88 R56.2
N$211
  Top 0.152: MOS57.3 51.88,16 51,16.88 50,16.88 R57.2
N$215
  Top 0.152: MOS58.3 51.88,20 51,20.88 50,20.88 R58.2
N$219
  Top 0.152: MOS59.3 51.88,24 51,24.88 50,24.88 R59.2
N$223
  Top 0.152: MOS60.3 51.88,28 51,28.88 50,28.88 R60.2
N$225
  Top 0.152: MOS61.3 93.88,12 93,12.88 92,12.88 R61.2
N$228
  Top 0.152: MOS62.3 93.88,16 93,16.88 92,16.88 R62.2
N$232
  Top 0.152: MOS63.3 93.88,20 93,20.88 92,20.88 R63.2
N$236
  Top 0.152: MOS64.3 93.88,24 93,24.88 92,24.88 R64.2
N$240
  Top 0.152: MOS65.3 93.88,28 93,28.88 92,28.88 R65.2
N$244
  Top 0.152: MOS66.3 87.88,12 87,12.88 86,12.88 R66.2
N$248
  Top 0.152: MOS67.3 87.88,16 87,16.88 86,16.88 R67.2
N$252
  Top 0.152: MOS68.3 87.88,20 87,20.88 86,20.88 R68.2
N$256
  Top 0.152: MOS69.3 87.88,24 87,24.88 86,24.88 R69.2
N$260
  Top 0.152: MOS70.3 87.88,28 87,28.88 86,28.88 R70.2
N$262
  Top 0.152: MOS71.3 81.88,12 81,12.88 80,12.88 R71.2
N$265
  Top 0.152: MOS72.3 81.88,16 81,16.88 80,16.88 R72.2
N$269
  Top 0.152: MOS73.3 81.88,20 81,20.88 80,20.88 R73.2
N$273
  Top 0.152: MOS74.3 81.88,24 81,24.88 80,24.88 R74.2
N$277
  Top 0.152: MOS75.3 81.88,28 81,28.88 80,28.88 R75.2
N$281
  Top 0.152: MOS76.3 75.88,12 75,12.88 74,12.88 R76.2
N$289
  Top 0.152: MOS78.3 75.88,20 75,20.88 74,20.88 R78.2
N$293
  Top 0.152: MOS79.3 75.88,24 75,24.88 74,24.88 R79.2
N$297
  Top 0.152: MOS80.3 75.88,28 75,28.88 74,28.88 R80.2
OUTPUT1_1  (via drill 0.35)
  Top 0.152: v24.12,13.88 24.12,13 MOS1.2
  Bottom 0.152: v24.12,13.88 24.12,17 24.75,17.62 24.75,33.25 18.75,39.25 FO1.1
OUTPUT1_2  (via drill 0.35)
  Top 0.152: v24.12,17.88 24.12,17 MOS2.2
  Bottom 0.152: v24.12,17.88 24.12,21.62 24.38,21.88 24.38,33.12 19,38.5 16.12,38.5 15.88,38.25 15.62,38.25 15.25,38.62 FO1.2
OUTPUT1_3  (via drill 0.35)
  Top 0.152: v22.88,21 24,21 MOS3.2
  Bottom 0.152: v22.88,21 22.88,25 23.88,26 23.88,33.12 18.88,38.12 16.25,38.12 16,37.88 15.5,37.88 14.75,38.62 FO1.3
OUTPUT1_4  (via drill 0.35)
  Top 0.152: v23,26 24,25 MOS4.2
  Bottom 0.152: v23,26 23,28.25 23.5,28.75 23.5,33 18.75,37.75 16.38,37.75 16.12,37.5 15.38,37.5 14.25,38.62 FO1.4
OUTPUT1_5  (via drill 0.35)
  Top 0.152: v22.88,29 24,29 MOS5.2
  Bottom 0.152: v22.88,29 22.88,29.88 18.88,33.88 18.88,37.12 18.62,37.38 16.62,37.38 16.38,37.12 15.25,37.12 13.75,38.62 FO1.5
OUTPUT1_6  (via drill 0.35)
  Top 0.152: v16.88,13 18,13 MOS6.2
  Bottom 0.152: v16.88,13 16.88,18.12 18.88,20.12 18.88,26.88 17.75,28 17.75,31.88 17,32.62 17,34.25 15.75,35.5 15.75,35.62 13.25,38.12 FO1.6
OUTPUT1_7  (via drill 0.35)
  Top 0.152: v18.12,17.88 18.12,17 MOS7.2 | v17.62,32.88 16.5,34 v16.38,34
  Bottom 0.152: v18.12,17.88 18.12,18.38 19.62,19.88 19.62,30.88 v17.62,32.88 | v16.38,34 16.38,34.38 15.38,35.38 15.38,35.5 12.75,38.12 FO1.7
OUTPUT1_8  (via drill 0.35)
  Top 0.152: v15.88,23.12 18,21 MOS8.2 | v14.75,35.25 v13.62,34.12
  Bottom 0.152: v15.88,23.12 15.88,31.88 v13.62,34.12 | v14.75,35.25 14.75,35.62 12.25,38.12 FO1.8
OUTPUT1_9  (via drill 0.35)
  Top 0.152: v17.12,25.88 18,25 MOS9.2
  Bottom 0.152: v17.12,25.88 17.12,29.75 17.38,30 17.38,31.75 11.75,37.38 FO1.9
OUTPUT1_10  (via drill 0.35)
  Top 0.152: v16.75,30.25 18,29 MOS10.2
  Bottom 0.152: v16.75,30.25 16.75,31.88 11.25,37.38 FO1.10
OUTPUT1_11  (via drill 0.35)
  Top 0.152: v12.12,13.88 12.12,13 MOS11.2
  Bottom 0.152: v12.12,13.88 12.12,16.5 13,17.38 13,35.12 10.75,37.38 FO1.11
OUTPUT1_12  (via drill 0.35)
  Top 0.152: v10.88,17 12,17 MOS12.2 | v10.25,36 v9,34.75
  Bottom 0.152: v10.88,17 10.88,25.25 9,27.12 v9,34.75 | FO1.12 v10.25,36
OUTPUT1_13  (via drill 0.35)
  Top 0.152: v11.75,21.88 12,21.62 12,21 MOS13.2
  Bottom 0.152: v11.75,21.88 11.75,33.62 9.62,35.75 9.62,36.5 9.75,36.62 FO1.13
OUTPUT1_14  (via drill 0.35)
  Top 0.152: v10.75,26.25 12,25 MOS14.2
  Bottom 0.152: v10.75,26.25 10.75,33.88 9.25,35.38 9.25,36.62 9.38,36.75 9.38,38.5 9.25,38.62 FO1.14
OUTPUT1_15  (via drill 0.35)
  Top 0.152: v8.75,37 8.38,36.62 8.38,34.5 12,30.88 12,29 MOS15.2
  Bottom 0.152: FO1.15 v8.75,37
OUTPUT1_16  (via drill 0.35)
  Top 0.152: v6.12,13.88 6.12,13 MOS16.2
  Bottom 0.152: v6.12,13.88 6.12,17 8.12,19 8.12,38.5 8.25,38.62 FO1.16
OUTPUT1_17  (via drill 0.35)
  Top 0.152: v6.12,17.88 6.12,17 MOS17.2
  Bottom 0.152: v6.12,17.88 6.12,21 7.75,22.62 FO1.17
OUTPUT1_18  (via drill 0.35)
  Top 0.152: v6.12,21.88 6.12,21 MOS18.2
  Bottom 0.152: v6.12,21.88 6.12,25 7.25,26.12 FO1.18
OUTPUT1_19  (via drill 0.35)
  Top 0.152: v6.12,25.88 6.12,25 MOS19.2
  Bottom 0.152: v6.12,25.88 6.12,29.38 6.75,30 FO1.19
OUTPUT1_20  (via drill 0.35)
  Top 0.152: v6.12,30.25 6.12,29 MOS20.2
  Bottom 0.152: v6.12,30.25 6.12,39.12 FO1.20
OUTPUT2_1  (via drill 0.35)
  Top 0.152: v48.12,13.88 48.12,13 MOS21.2
  Bottom 0.152: v48.12,13.88 48.12,17 49,17.88 49,22.25 48.25,23 48.25,25.62 48,25.88 48,27.75 48.62,28.38 48.62,32.38 41.75,39.25 FO2.1
OUTPUT2_2  (via drill 0.35)
  Top 0.152: v48.12,17.88 48.12,17 MOS22.2
  Bottom 0.152: v48.12,17.88 48.12,21.12 48.62,21.62 48.62,22.12 47.88,22.88 47.88,25.5 47.62,25.75 47.62,27.88 48.25,28.5 48.25,29.5 43.12,34.62 41.62,34.62 40.25,36 FO2.2
OUTPUT2_3  (via drill 0.35)
  Top 0.152: v48,21.88 48,21 MOS23.2
  Bottom 0.152: v48,21.88 48,22.25 47.5,22.75 47.5,25.38 47.25,25.62 47.25,28 47.88,28.62 47.88,29.38 43,34.25 41.5,34.25 39.75,36 FO2.3
OUTPUT2_4  (via drill 0.35)
  Top 0.152: v46.88,25 48,25 MOS24.2
  Bottom 0.152: v46.88,25 46.88,28.12 47.5,28.75 47.5,29.25 47.12,29.62 46.62,29.62 46.38,29.38 44.25,29.38 39.25,34.38 FO2.4
OUTPUT2_5  (via drill 0.35)
  Top 0.152: v46.88,29 48,29 MOS25.2
  Bottom 0.152: v46.88,29 44.12,29 38.88,34.25 38.88,38.5 38.75,38.62 FO2.5
OUTPUT2_6  (via drill 0.35)
  Top 0.152: v42.12,13.88 42.12,13 MOS26.2
  Bottom 0.152: v42.12,13.88 42.12,17 43,17.88 43,29.62 38.5,34.12 38.5,38.38 38.25,38.62 FO2.6
OUTPUT2_7  (via drill 0.35)
  Top 0.152: v42.12,17.88 42.12,17 MOS27.2
  Bottom 0.152: v42.12,17.88 42.12,25.12 42.62,25.62 42.62,29.5 38.12,34 38.12,38.25 37.75,38.62 FO2.7
OUTPUT2_8  (via drill 0.35)
  Top 0.152: v40.88,21 42,21 MOS28.2 | v37.5,37.25 v36.38,36.12
  Bottom 0.152: v40.88,21 40.88,29 37.5,32.38 37.5,33.12 36.38,34.25 v36.38,36.12 | v37.5,37.25 37.5,37.62 37.25,37.88 FO2.8
OUTPUT2_9  (via drill 0.35)
  Top 0.152: v42,25.88 42,25 MOS29.2
  Bottom 0.152: v42,25.88 42,29.62 37.38,34.25 37.38,36.5 36.75,37.12 FO2.9
OUTPUT2_10  (via drill 0.35)
  Top 0.152: v40.62,30.12 40.88,30.12 42,29 MOS30.2
  Bottom 0.152: v40.62,30.12 40.62,30.5 37,34.12 37,36.38 36.25,37.12 FO2.10
OUTPUT2_11  (via drill 0.35)
  Top 0.152: v36.5,13.88 36.12,13.5 36.12,13 MOS31.2
  Bottom 0.152: v36.5,13.88 36.5,14.25 37.12,14.88 37.12,33 35.75,34.38 FO2.11
OUTPUT2_12  (via drill 0.35)
  Top 0.152: v34.75,18.25 36,17 MOS32.2 | v36,31.62 v33.5,31.62
  Bottom 0.152: v34.75,18.25 34.75,20.25 33.5,21.5 v33.5,31.62 | v36,31.62 36,33.62 35.25,34.38 FO2.12
OUTPUT2_13  (via drill 0.35)
  Top 0.152: v34.88,21 36,21 MOS33.2
  Bottom 0.152: v34.88,21 34.88,25.5 35.38,26 35.38,33.75 34.75,34.38 FO2.13
OUTPUT2_14  (via drill 0.35)
  Top 0.152: v34.75,26.25 36,25 MOS34.2
  Bottom 0.152: v34.75,26.25 34.75,33.12 33.75,34.12 33.75,35.5 34.25,36 FO2.14
OUTPUT2_15  (via drill 0.35)
  Top 0.152: v34.12,30.88 36,29 MOS35.2
  Bottom 0.152: v34.12,30.88 34.12,32.25 33.25,33.12 33.25,35.5 33.75,36 FO2.15
OUTPUT2_16  (via drill 0.35)
  Top 0.152: v29.12,13.88 30,13 MOS36.2
  Bottom 0.152: v29.12,13.88 29.12,16 32.88,19.75 32.88,35.62 33.25,36 FO2.16
OUTPUT2_17  (via drill 0.35)
  Top 0.152: v30.12,17.88 30.12,17 MOS37.2
  Bottom 0.152: v30.12,17.88 30.12,33.38 32.75,36 FO2.17
OUTPUT2_18  (via drill 0.35)
  Top 0.152: v28.88,21 30,21 MOS38.2
  Bottom 0.152: v28.88,21 28.88,23.75 29.75,24.62 29.75,33.5 32.25,36 FO2.18
OUTPUT2_19  (via drill 0.35)
  Top 0.152: v28.25,25 30,25 MOS39.2
  Bottom 0.152: v28.25,25 28.25,32.5 31.12,35.38 31.12,38 31.75,38.62 FO2.19
OUTPUT2_20  (via drill 0.35)
  Top 0.152: v27.25,31.75 30,29 MOS40.2
  Bottom 0.152: v27.25,31.75 27.25,36.25 30.25,39.25 FO2.20
OUTPUT3_1  (via drill 0.35)
  Top 0.152: v72.12,13.88 72.12,13 MOS41.2
  Bottom 0.152: v72.12,13.88 72.12,14.38 73,15.25 73,33.5 67.25,39.25 FO3.1
OUTPUT3_2  (via drill 0.35)
  Top 0.152: v72.12,17.88 72.12,17 MOS42.2
  Bottom 0.152: v72.12,17.88 72.12,18.25 72.62,18.75 72.62,33.38 67.75,38.25 65.62,38.25 65.25,38.62 FO3.2
OUTPUT3_3  (via drill 0.35)
  Top 0.152: v71,22 72,21 MOS43.2
  Bottom 0.152: v71,22 71,24.88 71.88,25.75 71.88,29.38 64.75,36.5 FO3.3
OUTPUT3_4  (via drill 0.35)
  Top 0.152: v71.12,25.88 72,25 MOS44.2
  Bottom 0.152: v71.12,25.88 71.12,28.38 71.5,28.75 71.5,29.25 64.25,36.5 FO3.4
OUTPUT3_5  (via drill 0.35)
  Top 0.152: v70.88,29 72,29 MOS45.2
  Bottom 0.152: v70.88,29 70.88,29.38 63.75,36.5 FO3.5
OUTPUT3_6  (via drill 0.35)
  Top 0.152: v66.12,13.88 66.12,13 MOS46.2
  Bottom 0.152: v66.12,13.88 66.12,21.62 65.88,21.88 65.88,33 63.25,35.62 FO3.6
OUTPUT3_7  (via drill 0.35)
  Top 0.152: v65.5,17.88 66,17.38 66,17 MOS47.2
  Bottom 0.152: v65.5,17.88 65.5,32.88 62.88,35.5 62.88,38.5 62.75,38.62 FO3.7
OUTPUT3_8  (via drill 0.35)
  Top 0.152: v63.38,23.12 63.88,23.12 66,21 MOS48.2 | v61.75,32.38 61,33.12 61,36.62 v62.25,37.88
  Bottom 0.152: v63.38,23.12 63.38,30.75 v61.75,32.38 | FO3.8 v62.25,37.88
OUTPUT3_9  (via drill 0.35)
  Top 0.152: v64.88,25 66,25 MOS49.2
  Bottom 0.152: v64.88,25 64.88,31.75 62,34.62 62,37.25 61.62,37.62 61.62,38.5 61.75,38.62 FO3.9
OUTPUT3_10  (via drill 0.35)
  Top 0.152: v61.62,33.38 66,29 MOS50.2
  Bottom 0.152: v61.62,33.38 61.62,37.12 61.25,37.5 FO3.10
OUTPUT3_11  (via drill 0.35)
  Top 0.152: v57.62,14.38 59,13 60,13 MOS51.2 | v60.75,22 v58.12,22
  Bottom 0.152: v57.62,14.38 57.62,20 57.88,20.25 57.88,21.75 v58.12,22 | FO3.11 v60.75,22
OUTPUT3_12  (via drill 0.35)
  Top 0.152: v60.12,17.88 60.12,17 MOS52.2
  Bottom 0.152: v60.12,17.88 60.12,38.5 60.25,38.62 FO3.12
OUTPUT3_13  (via drill 0.35)
  Top 0.152: v58.88,21 60,21 MOS53.2
  Bottom 0.152: v58.88,21 58.88,21.38 59.38,21.88 59.38,25.62 58.25,26.75 58.25,28.38 59.75,29.88 FO3.13
OUTPUT3_14  (via drill 0.35)
  Top 0.152: v59.12,36.12 58.38,35.38 58.38,29.38 59.38,28.38 60,28.38 60.88,27.5 60.88,26.62 60.12,25.88 60.12,25 MOS54.2
  Bottom 0.152: v59.12,36.12 59.12,38.5 59.25,38.62 FO3.14
OUTPUT3_15  (via drill 0.35)
  Top 0.152: v59,30 60,29 MOS55.2
  Bottom 0.152: v59,30 59,35.38 58.5,35.88 58.5,38.38 58.75,38.62 FO3.15
OUTPUT3_16  (via drill 0.35)
  Top 0.152: v54.12,13.88 54.12,13 MOS56.2
  Bottom 0.152: v54.12,13.88 54.12,17 57.5,20.38 57.5,31.5 58.12,32.12 58.12,38.5 58.25,38.62 FO3.16
OUTPUT3_17  (via drill 0.35)
  Top 0.152: v54.12,17.88 54.12,17 MOS57.2
  Bottom 0.152: v54.12,17.88 54.12,21.38 57.12,24.38 57.12,31.62 57.75,32.25 FO3.17
OUTPUT3_18  (via drill 0.35)
  Top 0.152: v54,22.12 54,21 MOS58.2
  Bottom 0.152: v54,22.12 54,24.88 56.5,27.38 56.5,31.5 57.12,32.12 57.12,38.5 57.25,38.62 FO3.18
OUTPUT3_19  (via drill 0.35)
  Top 0.152: v54.12,25.88 54.12,25 MOS59.2
  Bottom 0.152: v54.12,25.88 54.12,29.62 56.62,32.12 56.62,38.5 56.75,38.62 FO3.19
OUTPUT3_20  (via drill 0.35)
  Top 0.152: v54.12,30.5 54.12,29 MOS60.2
  Bottom 0.152: v54.12,30.5 54.12,33.38 56.25,35.5 FO3.20
OUTPUT4_1  (via drill 0.35)
  Top 0.152: v96.88,13.75 96.12,13 MOS61.2
  Bottom 0.152: v96.88,13.75 96.88,14.5 97.88,15.5 97.88,34.12 92.75,39.25 FO4.1
OUTPUT4_2  (via drill 0.35)
  Top 0.152: v97.25,17 96.12,17 MOS62.2
  Bottom 0.152: v97.25,17 97.25,34.25 93.25,38.25 90.62,38.25 90.25,38.62 FO4.2
OUTPUT4_3  (via drill 0.35)
  Top 0.152: v96,21.88 96,21 MOS63.2
  Bottom 0.152: v96,21.88 96,35 93.12,37.88 90.5,37.88 89.75,38.62 FO4.3
OUTPUT4_4  (via drill 0.35)
  Top 0.152: v90.75,36.62 97.25,30.12 97.25,25.88 96.38,25 96.12,25 MOS64.2
  Bottom 0.152: v90.75,36.62 89.5,37.88 89.5,38.38 89.25,38.62 FO4.4
OUTPUT4_5  (via drill 0.35)
  Top 0.152: v94.75,30.25 96,29 MOS65.2
  Bottom 0.152: v94.75,30.25 94.75,31.38 89.38,36.75 89.38,37.25 89.12,37.5 89.12,38.25 88.75,38.62 FO4.5
OUTPUT4_6  (via drill 0.35)
  Top 0.152: v93.25,13.88 91.12,13.88 90.25,13 90.12,13 MOS66.2
  Bottom 0.152: v93.25,13.88 93.25,32.38 89,36.62 89,37.12 88.75,37.38 88.75,37.88 88.25,38.38 FO4.6
OUTPUT4_7  (via drill 0.35)
  Top 0.152: v89.75,17.88 90,17.62 90,17 MOS67.2
  Bottom 0.152: v89.75,17.88 89.75,21.62 89.38,22 89.38,35.75 88.62,36.5 88.62,37 88.38,37.25 88.38,37.75 87.75,38.38 FO4.7
OUTPUT4_8  (via drill 0.35)
  Top 0.152: v88.88,21 90,21 MOS68.2 | v88,36.75 v87.12,35.88
  Bottom 0.152: v88.88,21 88.88,29.25 87.12,31 v87.12,35.88 | v88,36.75 88,37.62 87.25,38.38 FO4.8
OUTPUT4_9  (via drill 0.35)
  Top 0.152: v87.25,37.5 86.5,36.75 86.5,31.62 88.88,29.25 88.88,26.5 90,25.38 90,25 MOS69.2
  Bottom 0.152: v87.25,37.5 87.25,37.88 86.75,38.38 FO4.9
OUTPUT4_10  (via drill 0.35)
  Top 0.152: v88.75,30.25 90,29 MOS70.2
  Bottom 0.152: v88.75,30.25 88.75,35.12 86.25,37.62 FO4.10
OUTPUT4_11  (via drill 0.35)
  Top 0.152: v87.25,17.88 85.12,17.88 85,17.75 85,14.75 84.12,13.88 84.12,13 MOS71.2
  Bottom 0.152: v87.25,17.88 87.25,29.25 85.75,30.75 FO4.11
OUTPUT4_12  (via drill 0.35)
  Top 0.152: v83.25,18.12 84,17.38 84,17 MOS72.2
  Bottom 0.152: v83.25,18.12 83.25,20.5 83.5,20.75 83.5,24.25 83.88,24.62 83.88,28.12 85.25,29.5 FO4.12
OUTPUT4_13  (via drill 0.35)
  Top 0.152: v82.88,21 84,21 MOS73.2
  Bottom 0.152: v82.88,21 82.88,24.12 83.5,24.75 83.5,28.25 83.88,28.62 83.88,37.75 84.75,38.62 FO4.13
OUTPUT4_14  (via drill 0.35)
  Top 0.152: v82.88,25 84,25 MOS74.2
  Bottom 0.152: v82.88,25 82.88,28.12 83.5,28.75 83.5,37.88 84.25,38.62 FO4.14
OUTPUT4_15  (via drill 0.35)
  Top 0.152: v82.88,29 84,29 MOS75.2
  Bottom 0.152: v82.88,29 82.88,37.75 83.75,38.62 FO4.15
OUTPUT4_16  (via drill 0.35)
  Top 0.152: v78.12,13.88 78.12,13 MOS76.2
  Bottom 0.152: v78.12,13.88 78.12,17 82.25,21.12 82.25,37.62 83.25,38.62 FO4.16
OUTPUT4_17  (via drill 0.35)
  Top 0.152: v78.12,17.88 78.12,17 MOS77.2
  Bottom 0.152: v78.12,17.88 78.12,21 81.62,24.5 81.62,37.5 82.75,38.62 FO4.17
OUTPUT4_18  (via drill 0.35)
  Top 0.152: v78.12,21.88 78.12,21 MOS78.2
  Bottom 0.152: v78.12,21.88 78.12,30 81.25,33.12 81.25,37.62 82.25,38.62 FO4.18
OUTPUT4_19  (via drill 0.35)
  Top 0.152: v80,32.88 79,31.88 79,26.75 78.12,25.88 78.12,25 MOS79.2
  Bottom 0.152: v80,32.88 80,34.25 80.88,35.12 80.88,37.75 81.75,38.62 FO4.19
OUTPUT4_20  (via drill 0.35)
  Top 0.152: v78.12,31.5 78.12,29 MOS80.2
  Bottom 0.152: v78.12,31.5 78.12,37.12 80.25,39.25 FO4.20
VIN
  Bottom 0.152: 103,21 LDO_C1.1
  Bottom 1.016: JP2.1 JP1.1 99.73,28.73 99,28 99,20.95 LDO_R3.1 101.05,21 103,21 | LDO_C1.1 104.3,19.75 LDO.IN
VOUT  (via drill 0.35)
  Top 0.152: R17.1 3.3,13.75 v3.55,13.75 | v3.6,10.5 2.55,10.5 R16.1 | R2.1 21,14.05 v21.45,14.05 | v21.4,10.9 20.15,10.9 R1.1
  Bottom 0.152: 109,21 LDO_C2.1 | v107.75,17.62 107.7,17.62 | v3.55,13.75 3.55,10.55 v3.6,10.5 | v21.45,14.05 21.45,10.95 v21.4,10.9
  Bottom 1.016: LDO.OUT 107.7,17.62 107.7,19.7 109,21 | LDO_C2.1 109.05,21 111,21 112,20 LDO_R1.2
  pour Top: -4,44 -4,-4 -5,-5 119,-5 124,0 124,41 120,45 -3,45

## Text on the board
tNames: Hsia & Warren / 20231013 / 80 Units MOS | 3V3 | IN_1 | IN_2 | IN_3 | IN_4
bNames: OUT_1 | OUT_2 | OUT_3 | OUT_4 | GND | GND | 3V3